# Altium schematic sheet Buck_12V.SchDoc
size Letter; SheetNumber: 5; SheetTotal: 8
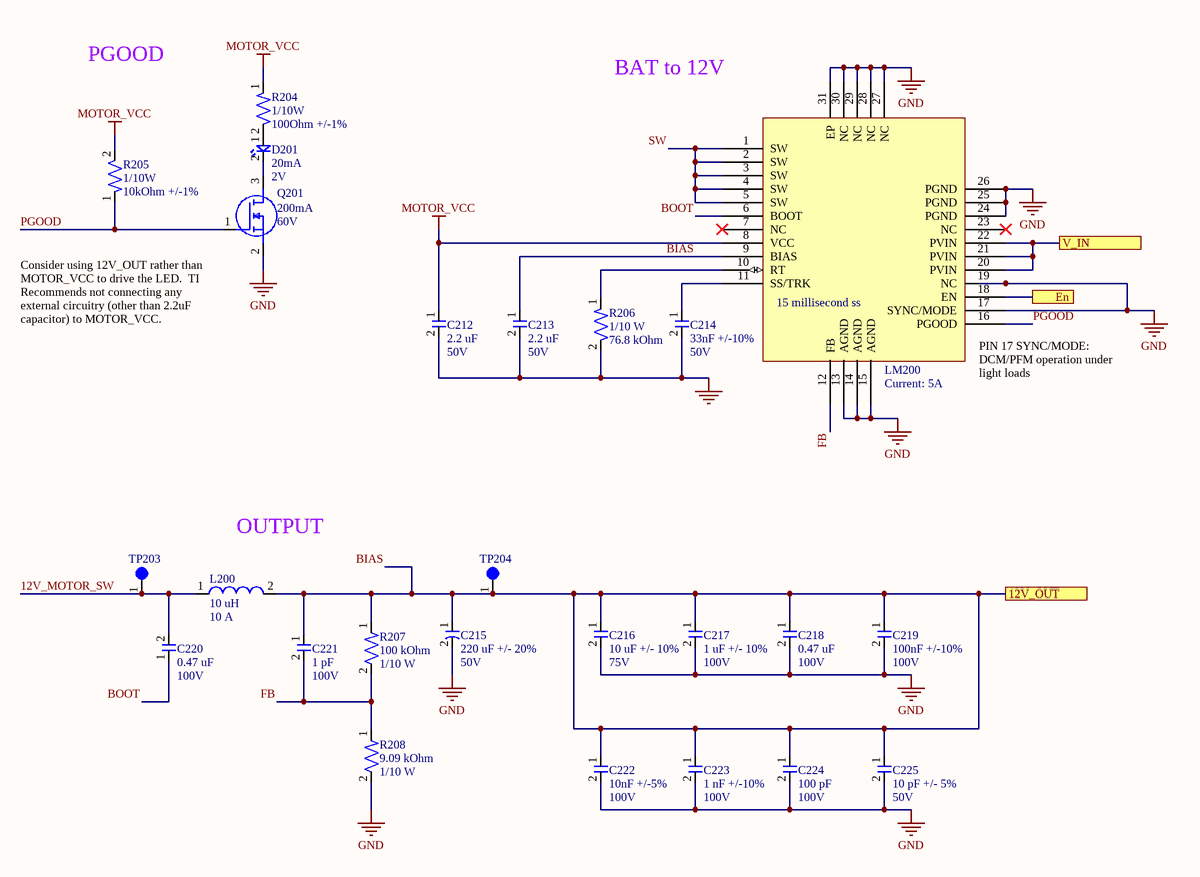
[diagram p0: Buck_12V.SchDoc]

## Parts
C212  Capacitance: 2.2 uF  oltage: 50V  [CAP-0603]  (hidden comment: UMK107BBJ225KA-T)
C213  Capacitance: 2.2 uF  oltage: 50V  [CAP-0603]  (hidden comment: UMK107BBJ225KA-T)
C214  Capacitance: 33nF +/-10%  Voltage Rating: 50V  [CAP-0603]  (hidden comment: CC0603KRX7R9BB333)
C215  Capacitance: 220 uF +/- 20%  Voltage Rating: 50V  [ELEC-220U-0003]  (hidden comment: 50TZV220M10X10.5)
C216  Capacitance: 10 uF +/- 10%  Voltage Rating: 75V  [CAP-1210]  (hidden comment: C3225X7R1N106K250AC)
C217  Capacitance: 1 uF +/- 10%  Voltage: 100V  [CAP-1206 - duplicate]  (hidden comment: CL31B105KCHNNNE)
C218  Capacitance: 0.47 uF  Voltage: 100V  [CAP-0805]  (hidden comment: KAM21KR72A474KL)
C219  Capacitance: 100nF +/-10%  Voltage Rating: 100V  [CAP-0603]  (hidden comment: CC0603KRX7R0BB104)
C220  Capacitance: 0.47 uF  Voltage: 100V  [CAP-0805]  (hidden comment: KAM21KR72A474KL)
C221  Capacitance: 1 pF  Voltage: 100V  [CAP-0603]  (hidden comment: 885012006087)
C222  Capacitance: 10nF +/-5%  Voltage Rating: 100V  [CAP-0603]  (hidden comment: C1608C0G2A103J080AC)
C223  Capacitance: 1 nF +/-10%  Voltage: 100V  [CAP-0603]  (hidden comment: C0603Y102K1RAC7867)
C224  Capacitance: 100 pF  Voltage: 100V  [CAP-0603]  (hidden comment: 0603N101J101CT)
C225  Capacitance: 10 pF +/- 5%  Voltage Rating: 50V  [CAP-0603]  (hidden comment: 0603N100J500CT)
D201  Current Rating: 20mA  Vf: 2V  [LED-0603]  (hidden comment: 150060AS75000)
L200  Inductance: 10 uH  DCI: 10 A  [PWRIND-10U-0002]  (hidden comment: SRP1270-100M)
LM200  Current: 5A  [IC-30-WQFN(6x4)]  (hidden comment: LM76005RNPR)
Q201  Id-Continuous: 200mA  VDS-Max: 60V  [NMOS-SOT23-3]  (hidden comment: T2N7002AK,LM)
R204  Power Rating: 1/10W  Resistance: 100Ohm +/-1%  [RES-0603]  (hidden comment: AC0603FR-10100RL)
R205  Power Rating: 1/10W  Resistance: 10kOhm +/-1%  [RES-0603]  (hidden comment: RC0603FR-0710KP)
R206  Power: 1/10 W  Resistance: 76.8 kOhm  [RES-0603]  (hidden comment: RC0603FR-0776K8L)
R207  Resistance: 100 kOhm  Power: 1/10 W  [RES-0603]  (hidden comment: RC0603FR-07100KL)
R208  Resistance: 9.09 kOhm  Power: 1/10 W  [RES-0603]  (hidden comment: RC0603FR-079K09L)
TP203  5003  [TEST-POINT-0001]  (value not drawn)
TP204  5003  [TEST-POINT-0001]  (value not drawn)

## Ports
12V_OUT, En, V_IN

## Nets
GND: C215.2 C216.2 C217.2 C218.2 C219.2 C222.2 C223.2 C224.2 C225.2 LM200.13(AGND) LM200.14(AGND) LM200.15(AGND) LM200.17(SYNC/MODE) LM200.19(NC) LM200.24(PGND) LM200.25(PGND) LM200.26(PGND) LM200.27(NC) LM200.28(NC) LM200.29(NC) LM200.30(NC) LM200.31(EP) Q201.2(S) R208.2
MOTOR_VCC: C212.1 LM200.8(VCC) R204.1 R205.2
NetC212_2: C212.2 C213.2 C214.2 R206.2
12V_MOTOR_SW: C220.2 L200.1 TP203.1
BIAS: C213.1 C215.1 C216.1 C217.1 C218.1 C219.1 C221.1 C222.1 C223.1 C224.1 C225.1 L200.2 LM200.9(BIAS) R207.1 TP204.1 ; port 12V_OUT
BOOT: C220.1 LM200.6(BOOT)
En: LM200.18(EN) ; port En
FB: C221.2 LM200.12(FB) R207.2 R208.1
PGOOD: LM200.16(PGOOD) Q201.1(G) R205.1
SW: LM200.1(SW) LM200.2(SW) LM200.3(SW) LM200.4(SW) LM200.5(SW)
V_IN: LM200.20(PVIN) LM200.21(PVIN) LM200.22(PVIN) ; port V_IN
NetC214_1: C214.1 LM200.11(SS/TRK)
NetD201_1: D201.1 R204.2
NetD201_2: D201.2 Q201.3(D)
NetLM200_10: LM200.10(RT) R206.1

Not connected (* = marked no-connect by the designer): LM200 7(NC)* 23(NC)*

## Notes on the sheet
- PGOOD
- (near LM200) BAT to 12V
- (near Q201) Consider using 12V_OUT rather than MOTOR_VCC to drive the LED.  TI Recommends not connecting any external circuitry (other than 2.2uF capacitor) to MOTOR_VCC.
- (near LM200) 15 millisecond ss
- (near LM200) PIN 17 SYNC/MODE: DCM/PFM operation under light loads
- OUTPUT

## Library data of the parts
C212 C213 = CAP-2.2U-0001: 2.2 µF ±10% 50V Ceramic Capacitor X5R 0603 (1608 Metric)
C214 = CAP-33N-0001: 0.033 µF ±10% 50V Ceramic Capacitor X7R 0603 (1608 Metric); Manufacturer: YAGEO; Assembled?: no; Manufacturer Part Number: CC0603KRX7R9BB333; Temperature Coefficient: X7R; Package Size: 0603
C215 = ELEC-220U-0003: 220 µF 50 V Aluminum Electrolytic Capacitors Radial, Can - SMD 2000 Hrs @ 105°C; Size: .406inx.406in*.413in
C216 = CAP-10U-0004: 10 µF ±10% 75V Ceramic Capacitor X7R 1210 (3225 Metric)
C217 = CAP-1U-0001: 1 µF ±10% 100V Ceramic Capacitor X7R 1206 (3216 Metric)
C218 C220 = CAP-0.47U-0001: 0.47 µF ±10% 100V Ceramic Capacitor X7R 0805 (2012 Metric); Tolerance: +/- 10%; Assembled?: No; Temperature Coefficient: X7R; Package Size: 0805
C219 = CAP-100N-0001: CAP CER 0.1UF 100V X7R 0603; Manufacturer: YAGEO; Assembled?: no; Manufacturer Part Number: CC0603KRX7R0BB104; Temperature Coefficient: X7R; Package Size: 0603
C221 = CAP-1P-0001: 1 pF ±0.25pF 100V Ceramic Capacitor C0G, NP0 0603 (1608 Metric); Tolerance: +/- 0.25 pF; Temperature Coefficient: C0G/NP0; Assembled?: No; Package Size: 0603
C222 = CAP-10N-0002: CAP CER 10000PF 100V C0G 0603; Manufacturer: TDK Corporation; Temperature Coefficient: C0G/NP0; Assembled?: no; Manufacturer Part Number: C1608C0G2A103J080AC; Package Size: 0603
C223 = CAP-1N-0001: 1000 pF ±10% 100V Ceramic Capacitor X7R 0603 (1608 Metric)
C224 = CAP-100P-0002: 100 pF ±5% 100V Ceramic Capacitor C0G, NP0 0603 (1608 Metric); Tolerance: +/-5%; Temp Coeff: C0G/NP0; Package Size: 0603
C225 = CAP-10P-0001: 10 pF ±5% 50V Ceramic Capacitor C0G, NP0 0603 (1608 Metric); Manufacturer: Walshin Technology Corporation; Assembled?: Yes; Manufacturer Part Number: 0603N100J500CT; Temperature Coefficient: C0G, NP0; Package Size: 0603
D201 = LED_Amber_0001: CAP CER 0.1UF 100V X7R 0603; Manufacturer: Wurth Electronik; Assembled?: no; Color: Amber; Manufacturer Part Number: 150060AS75000; Package Size: 0603
L200 = PWRIND-10U-0002: 10 µH Shielded Drum Core, Wirewound Inductor 10 A 16.8mOhm Max Nonstandard; Tolerance: +/- 20%; Isat: 16A; Assembled?: No; DCR: 16.8 mOhm
LM200 = IC-BUCK-0006: Buck Switching Regulator IC Positive Adjustable 1V 1 Output 5A 30-WFQFN Exposed Pad; Manufacturer: Texas Instruments; Assembled?: no; Manufacturer Part Number: LM76005RNPR; Type: Buck; Package: 30-WFQFN
Q201 = NMOS-200MA-0001: MOSFET N-CH 60V 200MA SOT23; Manufacturer: Toshiba; FET type: N-Channel; Rds On-Max: 3.9Ohm; Vgs-Max: 20V; Assembled?: no; Manufacturer Part Number: T2N7002AK,LM; Package: SOT-23-3
R204 = RES-100-0002: 100 Ohms ±1% 0.1W, 1/10W Chip Resistor 0603 (1608 Metric) Automotive AEC-Q200 Thick Film; Manufacturer: YAGEO; Assembled?: no; Manufacturer Part Number: AC0603FR-10100RL; Package Size: 0603
R205 = RES-10K-0002: RES SMD 10K OHM 1% 1/10W 0603; Manufacturer: YAGEO; Assembled?: no; Manufacturer Part Number: RC0603FR-0710KP; Package Size: 0603
R206 = RES-76.8K-0001: 76.8 kOhms ±1% 0.1W, 1/10W Chip Resistor 0603 (1608 Metric) Moisture Resistant Thick Film; Manufacturer: Yageo; Tolerance: +/- 1%; Package Size: 0603
R207 = RES-100K-0003: 100 kOhms ±1% 0.1W, 1/10W Chip Resistor 0603 (1608 Metric) Moisture Resistant Thick Film; Tolerance: +/- 1%; Assembled?: No; Package Size: 0603
R208 = RES-9.09K-0001: 9.09 kOhms ±1% 0.1W, 1/10W Chip Resistor 0603 (1608 Metric) Moisture Resistant Thick Film; Tolerance: +/-1%; Assembled?: No; Package Size: 0603
TP203 TP204 = TEST-POINT-0001: Oranange PC Test Point, Miniature Phoisphor Bronze Silver Plating Through Hole Mounting Type